# EAGLE design ProgAdapter (EAGLE 9.4.2)
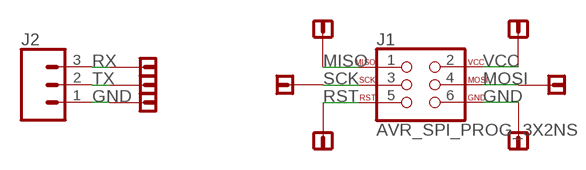
[diagram p0: schematic, sheet 1]

## Parts
J1  AVR_SPI_PROG_3X2NS  [2X3-NS]
J2  CONN_03  [1X03]
U$1  SIMPLE_VIA_CONNECTION  [SIMPLEVIA]
U$2  SIMPLE_VIA_CONNECTION  [SIMPLEVIA]
U$3  SIMPLE_VIA_CONNECTION  [SIMPLEVIA]
U$4  SIMPLE_VIA_CONNECTION  [SIMPLEVIA]
U$5  SIMPLE_VIA_CONNECTION  [SIMPLEVIA]
U$6  SIMPLE_VIA_CONNECTION  [SIMPLEVIA]
U$7  SIMPLE_VIA_CONNECTION  [SIMPLEVIA]
U$8  SIMPLE_VIA_CONNECTION  [SIMPLEVIA]
U$9  SIMPLE_VIA_CONNECTION  [SIMPLEVIA]

## Nets
GND: J1.6 J2.1 U$4.P$1 U$9.P$1
MISO: J1.1 U$1.P$1
MOSI: J1.4 U$5.P$1
RST: J1.5 U$3.P$1
RX: J2.3 U$7.P$1
SCK: J1.3 U$2.P$1
TX: J2.2 U$8.P$1
VCC: J1.2 U$6.P$1

## Library data of the parts
J1 = SparkFun-Connectors:AVR_SPI_PROG_3X2: AVR ISP 6 Pin This is the reduced ISP connector for AVR programming. Common on Arduino. This footprint will take up less PCB space and can be used with a 10-pin to 6-pin adapter such as SKU: BOB-08508 **Special note about "TEST_POINT" package. The stop mask is on the top side, so if you want your programming test points to be on the bottom of your board, make sure to place this package on the bottom side of the board. This also ensure that the orientation to program from the bottom side will be correct. SparkFun Products: SparkFun ISP Pogo Adapter <https://www.sparkfun.com/products/11591> - NS Tiny AVR Programmer <https://www.sparkfun.com/products/11801> -PTH
J2 = SparkFun-Connectors:CONN_03: Multi connection point. Often used as Generic Header-pin footprint for 0.1 inch spaced/style header connections On any of the 0.1 inch spaced packages, you can populate with these: Break Away Headers - Straight <https://www.sparkfun.com/products/116> (PRT-00116) Break Away Male Headers - Right Angle <https://www.sparkfun.com/products/553> (PRT-00553) Female Headers <https://www.sparkfun.com/products/115> (PRT-00115) Break Away Headers - Machine Pin <https://www.sparkfun.com/products/117> (PRT-00117) Break Away Female Headers - Swiss Machine Pin <https://www.sparkfun.com/products/743> (PRT-00743) Stackable Header - 3 Pin (Female, 0.1") <https://www.sparkfun.com/products/13875> (PRT-13875) For SCREWTERMINALS and SPRING TERMINALS visit here: Screw Terimnals on SparkFun.com <https://www.sparkfun.com/search/results?term=Screw+Terminals> (5mm/3.5mm/2.54mm spacing) This device is also useful as a general connection point to wire up your design to another part of your project. Our various solder wires solder well into these plated through hole pads. Hook-Up Wire - Assortment (Stranded, 22 AWG) <https://www.sparkfun.com/products/11375> (PRT-11375) Hook-Up Wire - Assortment (Solid Core, 22 AWG) <https://www.sparkfun.com/products/11367> (PRT-11367) View the entire wire category on our website here <https://www.sparkfun.com/categories/141> Special notes: Molex polarized connector foot print use with SKU : PRT-08232 with associated crimp pins and housings.
U$1-U$9 = FA3D_lib:SIMPLE_VIA_CONNECTION

## Net classes
0 default: width 0.2 mm

## Board
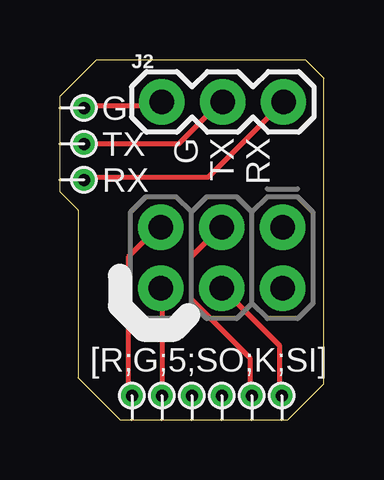
[diagram p1: board, top side]
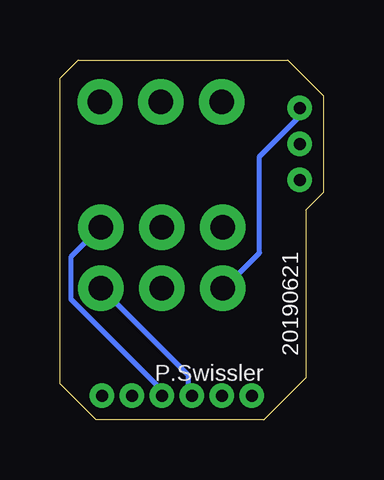
[diagram p2: board, bottom side, seen from below]

Size 11 x 15 mm. Coordinates in mm from the lower left corner, seen from the top.
Outline: 2.5,0 9.5,0 11,1.5 11,14.25 10.25,15 1.5,15 0.75,14.25 0,13.5 0,9.5 0.75,8.75 0.75,1.75 2.5,0
Copper layers (1*16): Top 0.035mm / dielectric 1.5mm / Bottom 0.035mm
Design rules "Swissler_Aggressive": minimum track width 0.1mm, minimum drill 0.3mm, track to track 0.15mm, track to pad 0.15mm, pad to pad 0.15mm, via to via 0.15mm, smd to smd 0.1mm, copper to edge 0.1mm, drill to drill 0.1mm, minimum pad ring 10mil, minimum via ring 8mil, stop-mask expansion 4mil, vias tented up to drill 25mil, thermal gap 0.125mm

### Footprints (pad centres in the part's own frame; a part is rotated, then mirrored left to right if it is on the bottom)
2X3-NS = drill 1.016 pad 1.88: 1 -2.54,-1.27; 2 -2.54,1.27; 3 0,-1.27; 4 0,1.27; 5 2.54,-1.27; 6 2.54,1.27
1X03 = drill 1.016 pad 1.88: 1 0,0; 2 2.54,0; 3 5.08,0
SIMPLEVIA = drill 0.5: P$1 0,0

### Placement (x,y rotation side)
J1  6.75,6.75 180 top
J2  4.25,13.25 0 top
U$1  6.75,1 0 top
U$2  8,1 0 top
U$3  3,1 0 top
U$4  4.25,1 0 top
U$5  9.25,1 0 top
U$6  5.5,1 0 top
U$7  1,10 270 top
U$8  1,11.5 270 top
U$9  1,13 270 top

### Tracks (layer width: path | path; a pad name or v marks a point on that pad's centre or on a via)
GND
  Top 0.2: J2.1 4.08,13.07 1.1,13.07 U$9.P$1 | U$4.P$1 4.25,5.38 J1.6
  Bottom 0.2: U$9.P$1 1.1,12.9 1.1,12.55 2.67,10.97 2.67,6.95 4.08,5.55 J1.6
MISO
  Bottom 0.2: U$1.P$1 6.88,1 6.88,1.35 10.55,5.03 10.55,6.78 9.32,8 J1.1
MOSI
  Top 0.2: U$5.P$1 9.15,1 9.15,3.1 6.88,5.38 J1.4
RST
  Top 0.2: U$3.P$1 2.85,1 2.85,6.78 4.08,8 J1.5
RX
  Top 0.2: U$7.P$1 1.1,10.1 6.17,10.1 J2.3
SCK
  Top 0.2: U$2.P$1 7.92,1 7.92,2.58 5.47,5.03 5.47,6.78 6.7,8 J1.3
TX
  Top 0.2: U$8.P$1 4.95,11.5 6.7,13.25 J2.2
VCC
  Bottom 0.2: U$6.P$1 5.65,1 5.65,1.88 9.15,5.38 J1.2

### Text on the board
tPlace: G / TX / RX | G / TX / RX | [R;G;5;SO;K;SI]
bPlace: 20190621 | P.Swissler